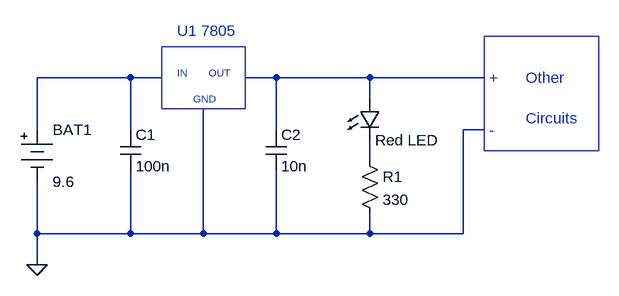
[diagram p0: schematic power_board.asc]
power_board.asc, the LTspice schematic file:
Version 4
SHEET 1 880 680
WIRE 64 32 -80 32
WIRE 112 32 64 32
WIRE 288 32 240 32
WIRE 432 32 288 32
WIRE 608 32 432 32
WIRE 432 64 432 32
WIRE -80 112 -80 32
WIRE 64 112 64 32
WIRE 288 112 288 32
WIRE 608 112 576 112
WIRE 432 160 432 128
WIRE -80 272 -80 192
WIRE 64 272 64 176
WIRE 64 272 -80 272
WIRE 176 272 176 80
WIRE 176 272 64 272
WIRE 288 272 288 176
WIRE 288 272 176 272
WIRE 432 272 432 240
WIRE 432 272 288 272
WIRE 576 272 576 112
WIRE 576 272 432 272
WIRE -80 320 -80 272
FLAG -80 320 0
SYMBOL cap 48 112 R0
SYMATTR InstName C1
SYMATTR Value 100n
SYMBOL cap 272 112 R0
SYMATTR InstName C2
SYMATTR Value 10n
SYMBOL LED 416 64 R0
WINDOW 0 24 0 Invisible 2
SYMATTR InstName LED
SYMATTR Value Red LED
SYMATTR Description Diode
SYMATTR Type diode
SYMBOL res 416 144 R0
SYMATTR InstName R1
SYMATTR Value 330
SYMBOL Misc\\battery -80 96 R0
WINDOW 123 0 0 Left 2
WINDOW 39 0 0 Left 2
SYMATTR InstName BAT1
SYMATTR Value 9.6
TEXT 136 24 Left 1 ;IN
TEXT 184 24 Left 1 ;OUT
TEXT 160 64 Left 1 ;GND
TEXT 136 -40 Left 2 ;U1 7805
TEXT 616 32 Left 2 ;+
TEXT 616 112 Left 2 ;-
TEXT 672 32 Left 2 ;Other\n \nCircuits
RECTANGLE Normal 240 80 112 -16
RECTANGLE Normal 784 144 608 -32

The netlist it stands for:
* power_board.asc
C1 N001 0 100n
C2 N002 0 10n
D§LED N002 N003 Red LED
R1 N003 0 330
V§BAT1 N001 0 9.6
.model D D
.lib standard.dio
* IN
* OUT
* GND
* U1 7805
* +
* -
* Other
* Circuits
.backanno
.end